# Altium schematic sheet HV_BMS_Slave1.SchDoc: HV_BMS_Slave1
size A4; Revision: V1.0; SheetNumber: 1; SheetTotal: 5
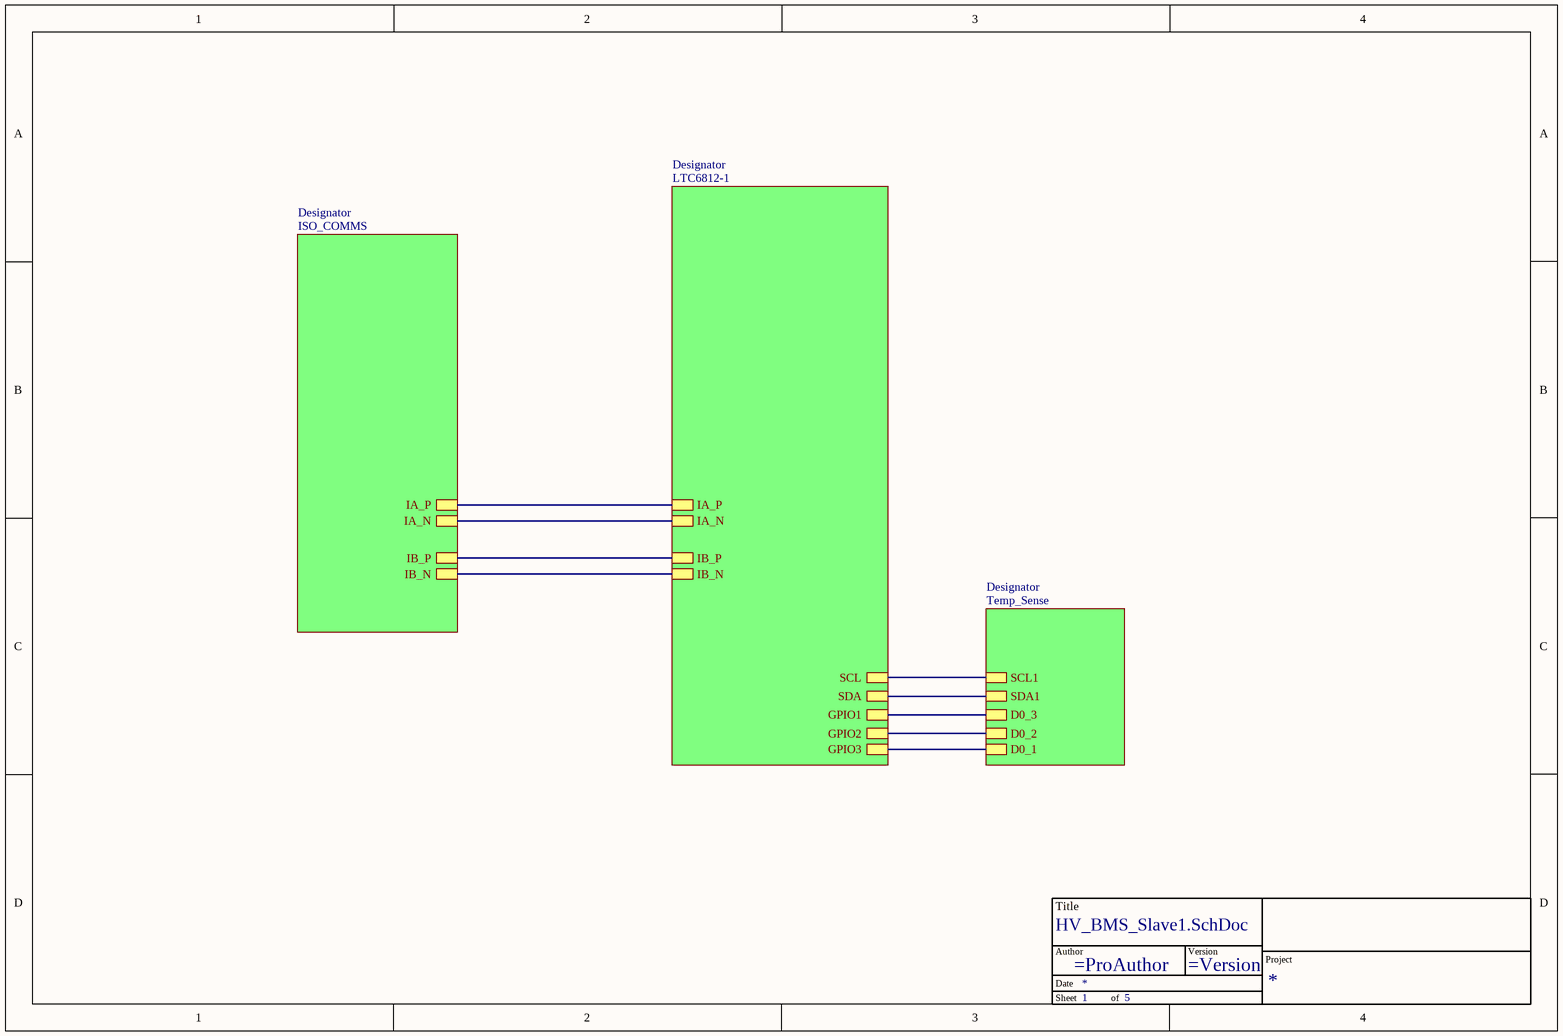
[diagram p0: HV_BMS_Slave1.SchDoc]

## Parts
*  TitleBlock  (value not drawn)  (graphical)

## Sub-sheets
Designator = LTC6812-1: SDA, SCL, GPIO1, GPIO2, GPIO3, IA_N, IA_P, IB_N, IB_P
Designator = ISO_COMMS: IA_N, IA_P, IB_N, IB_P
Designator = Temp_Sense: SDA1, SCL1, D0_3, D0_2, D0_1

## Nets
(unnamed): sheet Designator/SDA, sheet Designator/SDA1
(unnamed): sheet Designator/SCL, sheet Designator/SCL1
(unnamed): sheet Designator/GPIO1, sheet Designator/D0_3
(unnamed): sheet Designator/GPIO2, sheet Designator/D0_2
(unnamed): sheet Designator/GPIO3, sheet Designator/D0_1
(unnamed): sheet Designator/IA_N, sheet Designator/IA_N
(unnamed): sheet Designator/IA_P, sheet Designator/IA_P
(unnamed): sheet Designator/IB_N, sheet Designator/IB_N
(unnamed): sheet Designator/IB_P, sheet Designator/IB_P

## Notes on the sheet
- (in symbol TitleBlock) Title; Author; Version; Project; Date; Sheet; of